# Altium schematic sheet Sheet1.SchDoc
size A4; Author: Christian Kieser; Engineer: Christian Kieser
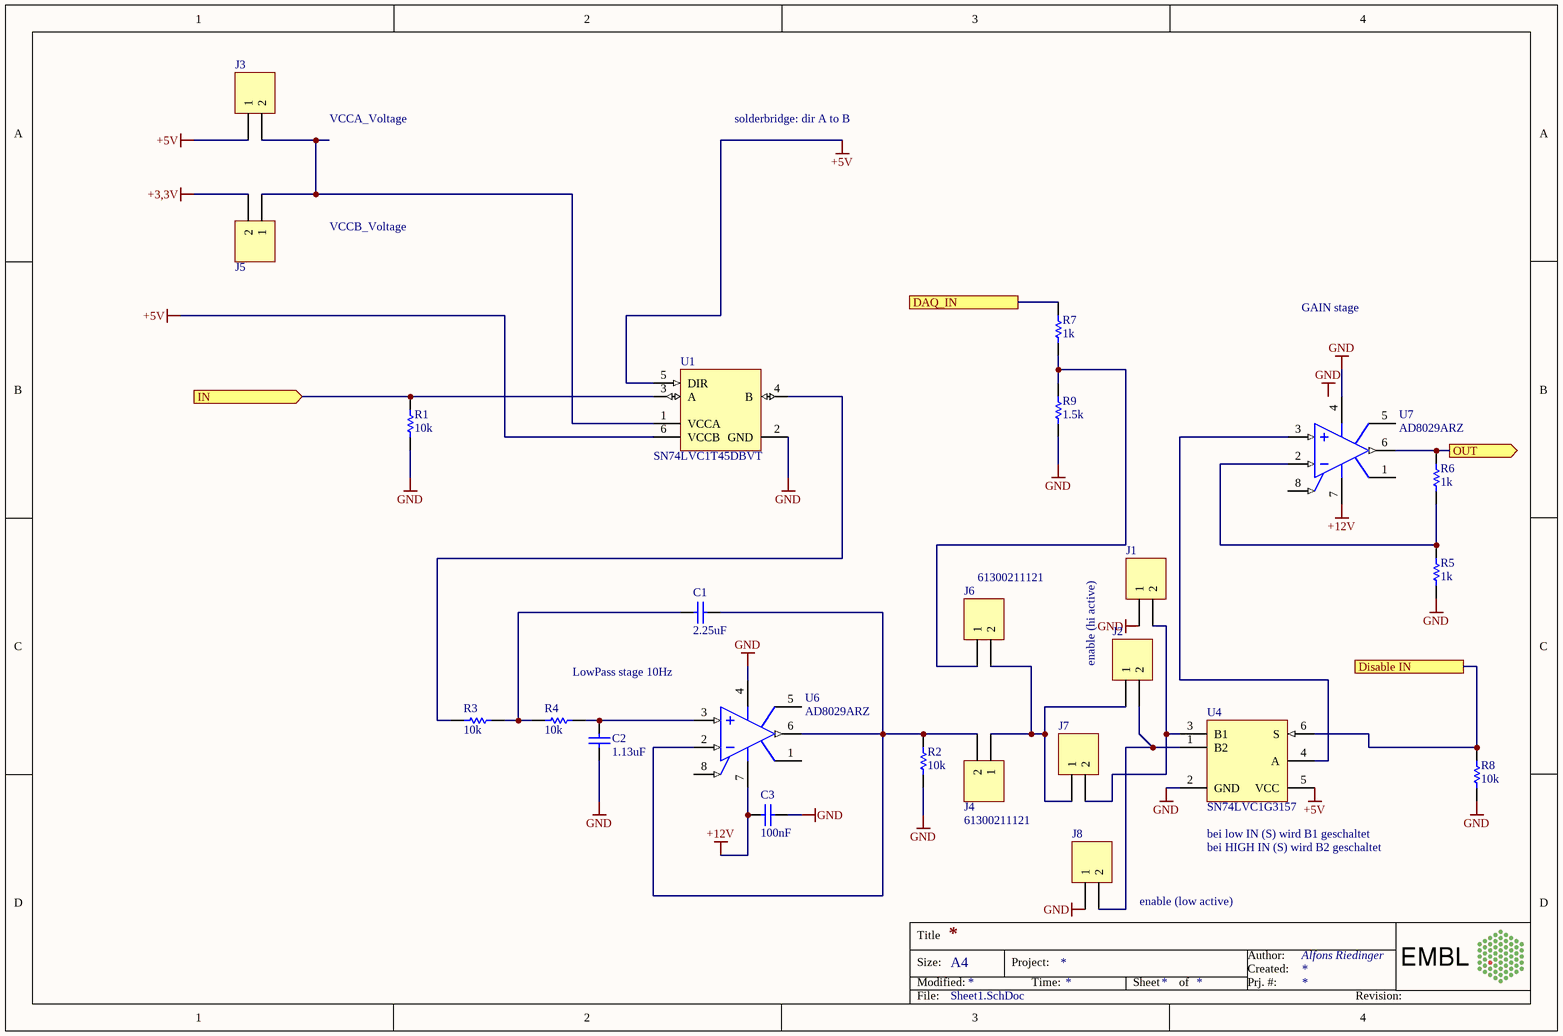
[diagram p0: Sheet1.SchDoc]

## Parts
C1  2.25uF  [CAPC1206(3216)190_N]
C2  1.13uF  [CAPC1206(3216)190_N]
C3  100nF  [CAPC2013X88X50ML20T25]
J1  61300211121  [61300211121]  (value not drawn)
J2  61300211121  [61300211121]  (value not drawn)
J3  61300211121  [61300211121]  (value not drawn)
J4  61300211121  [61300211121]
J5  61300211121  [61300211121]  (value not drawn)
J6  61300211121  [61300211121]
J7  61300211121  [61300211121]  (value not drawn)
J8  61300211121  [61300211121]  (value not drawn)
R1  10k  [YAGO-RC0805_M]
R2  10k  [YAGO-RC0805_M]
R3  10k  [YAGO-RC0805_M]
R4  10k  [YAGO-RC0805_M]
R5  1k  [YAGO-RC0805_M]
R6  1k  [YAGO-RC0805_M]
R7  1k  [YAGO-RC0805_M]
R8  10k  [YAGO-RC0805_M]
R9  1.5k  [YAGO-RC0805_M]
U1  SN74LVC1T45DBVT  [DBV0006A_M]
U4  SN74LVC1G3157  [DBV0006A_N]
U6  AD8029ARZ  [ADI-R-8_L]
U7  AD8029ARZ  [ADI-R-8_L]

## Ports
DAQ_IN, Disable IN, IN (in), OUT (out)

## Nets
+3,3V: J5.2
+5V: J3.1 U1.5(DIR) U1.6(VCCB) U4.5(VCC)
+12V: C3.2 U6.7(+VS) U7.7(+VS)
GND: C2.1 C3.1 J1.1 J8.1 R1.1 R2.1 R5.1 R8.2 R9.1 U1.2(GND) U4.2(GND) U6.4(-VS) U7.4(-VS)
DAQ_IN: R7.2 ; port DAQ_IN
Disable IN: R8.1 U4.6(S) ; port Disable IN
IN: R1.2 U1.3(A) ; port IN
OUT: R6.2 U7.6(VOUT) ; port OUT
NetC1_1: C1.1 R3.1 R4.2
NetC1_2: C1.2 J4.2 R2.2 U6.2(-IN) U6.6(VOUT)
NetC2_2: C2.2 R4.1 U6.3(+IN)
NetJ1_2: J1.2 J7.2 U4.3(B1)
NetJ2_1: J2.1 J4.1 J6.2 J7.1
NetJ2_2: J2.2 J8.2 U4.1(B2)
NetJ3_2: J3.2 J5.1 U1.1(VCCA)
NetJ6_1: J6.1 R7.1 R9.2
NetR3_2: R3.2 U1.4(B)
NetR5_2: R5.2 R6.1 U7.2(-IN)
NetU4_4: U4.4(A) U7.3(+IN)

Not connected (* = marked no-connect by the designer): U6 1(NC) 5(NC) 8(~{DISABLE}); U7 1(NC) 5(NC) 8(~{DISABLE})

## Notes on the sheet
- VCCA_Voltage
- solderbridge: dir A to B
- VCCB_Voltage
- GAIN stage
- LowPass stage 10Hz
- enable (hi active)
- (near U4) bei low IN (S) wird B1 geschaltet
- bei HIGH IN (S) wird B2 geschaltet
- (near J8) enable (low active)
- Labels drawn without touching a wire or pin: GND
- Title
- Size:
- Modified:
- A4
- Project:
- Time:
- Sheet
- of
- Created:
- Author:
- Prj. #:
- Alfons Riedinger
- File:
- Revision:

## Library data of the parts
C1 C2 = CMP-001-0138-A.1: CAP CER 1UF 10V X7R 1206; Manufacturer: Wurth Electronics Inc.; Manufacturer Part Number: 885012208013; Notification: Current market demand for these product types have resulted in fluctuating and extending lead times. Lead times may differ.; Tolerance: ±10%; Applications: General Purpose; ComponentLink1Description: 885012208013.pdf; ComponentLink1URL: http://katalog.we-online.de/pbs/datasheet/885012208013.pdf; Features: -; Height - Seated (Max): -; Lead Spacing: -; Lead Style: -; Mounting Type: Surface Mount, MLCC; Operating Temperature: -55°C ~ 125°C; Package / Case: 1206 (3216 Metric); Packaging: Cut Tape (CT); Part Status: Active; Ratings: -; Size / Dimension: 0.126" L x 0.063" W (3.20mm x 1.60mm); Supplier: Digi-Key; Supplier Part Number: 732-7685-1-ND; Temperature Coefficient: X7R; Thickness (Max): 0.051" (1.30mm); Voltage - Rated: 10V
C3 = CMP-001-0082-2: generic 0805 COG oder X7R Vielschichtkondensatoren max. +/-10%
J1-J8 = CMP-001-0071-1: 2Pol; gerade; WR-PHD 2.54 mm THT Pin Header; Brand: Wurth Electronics; Current Rating: 3 A; Insulation Resistance: 1 GOhms; Latching Type: Unlatched; Mating Post Length: 6 mm; Mounting Angle: Straight; Number of Positions: 2 Position; Pitch: 2.54 mm; Voltage Rating: 250 V; Accessory Type: -; Application: Wire to Board; ComponentLink1Description: 6130xx11121-538006.pdf; ComponentLink1URL: http://www.mouser.com/ds/2/445/6130xx11121-538006.pdf; Contact Gender: Pin (Male); Contact Material: Copper Alloy; Contact Plating: Gold; Contact Type: -; Flammability Rating: UL 94 V-0; Housing Gender: -; Housing Material: Polybutylene Terephthalate (PBT); Manufacturer: Wurth Electronics; Manufacturer Part Number: 61300211121; Minimum Order Quantity: 1; Mounting Style: Straight Pin; Number of Rows: 1 Row; Packaging: Bulk; Product: Headers; Reeling: False; RoHS - Mouser: Y; Row Spacing: -; Series: WR-PHD; Standard Pack Qty: 1000; Supplier: Mouser; Supplier Part Number: 710-61300211121; Termination Post Length: 3 mm; Termination Style: Through Hole; Type: Pin Strip; PartNumber: 61300211121
R1-R9 = CMP-001-0027-2: 0805 Yageo Standard BlackBox Resistors; Power (Watts): 0.125W, 1/8W; Temperature Coefficient: ±200ppm/°C; Tolerance: ±1%; ComponentLink1Description: PYu-RC_Group_51_RoHS_L_7.pdf; Part Status: Active; Size / Dimension: 0.079" L x 0.049" W (2.00mm x 1.25mm); Supplier Device Package: 0805; ComponentLink1URL: http://www.yageo.com/documents/recent/PYu-RC_Group_51_RoHS_L_7.pdf; Composition: Thick Film; Failure Rate: -; Features: Moisture Resistant; Height - Seated (Max): 0.024" (0.60mm); Manufacturer: Yageo; Operating Temperature: -55°C ~ 155°C; Package / Case: 0805 (2012 Metric); Packaging: Digi-Reel®
U1 = CMP-00492-1: Single-Bit Dual-Supply Bus Transceiver with Configurable Voltage Translation and 3-State Outputs, DBV0006A, SMALL T&R; Manufacturer: Texas Instruments; 3-State Output: Yes; VCC(Min)(V): 1.65; tpd @ Nom Voltage(Max)(ns): 15.5,8,5.8,4.4; Technology Family: LVC; Logic: True; Bits(#): 1; Rating: Catalog; Sub-Family: Dual Supply Translator; Schmitt Trigger: No; VCC(Max)(V): 5.5; Voltage(Nom)(V): 1.8,2.5,3.3,5; Output Drive (IOL/IOH)(Max)(mA): 32/-32; Input Type: CMOS/TTL; ICC @ Nom Voltage(Max)(mA): 0.004; Output Type: CMOS; F @ Nom Voltage(Max)(Mhz): 150; DatasheetVersion: SCES515K; Operating Temperature Range(C): -40 to 85; Generic Part Number: SN74LVC1T45; PackageReference: DBV0006A
U4 = CMP-001-0106-A.1: Analoger Schalter Single SPDT(Wechsler) SOT23-6; Manufacturer: Texas Instruments; Manufacturer Part Number: 74LVC1G3157DBVRE4; PartNumber: SN74LVC1G3157DBVR; -3db Bandwidth: 300MHz; Channel Capacitance (CS(off), CD(off)): 5.2pF; Channel-to-Channel Matching (&Delta;Ron): 100 mOhm; Charge Injection: 7pC; Crosstalk: -54dB @ 10MHz; Current - Leakage (IS(off)) (Max): 1µA; Multiplexer/Demultiplexer Circuit: 2:1; On-State Resistance (Max): 15 Ohm; Switch Time (Ton, Toff) (Max): 5.7ns, 3.8ns; Voltage - Supply, Single (V+): 1.65 V ~ 5.5 V; ComponentLink1Description: sn74lvc1g3157.pdf; ComponentLink1URL: http://www.ti.com/lit/ds/symlink/sn74lvc1g3157.pdf; Operating Temperature: -40°C ~ 85°C (TA); Package / Case: SOT-23-6; Packaging: Tape & Reel (TR); Part Status: Active; Supplier: Digi-Key; Supplier Device Package: SOT-23-6; Supplier Part Number: 74LVC1G3157DBVRE4-ND; Switch Circuit: SPDT; Voltage - Supply, Dual (V±): -
U6 U7 = CMP-00480-1: Single Channel RRIO Operational Amplifier, 125 MHz BW, 62 V/us SR, Industrial, 8-pin SOIC (R-8), Tube; Manufacturer: Analog Devices; Generic Part Number: AD8029; Slew Rate: 62V/us; V Span Min: 2.7V; Input Bias Current: 700nA; Amplifiers Per Package: 1; Iq/Amp: 1.5mA; V Span Max: 12V; Input Offset Voltage: 1.6mV; Small Signal Bandwidth: 125MHz; PackageVersion: 060506-A; ComponentLink3URL: http://www.analog.com/static/imported-files/packages/PKG_PDF/SOIC_Narrow%20(R)/R_8.pdf; ComponentLink1Description: Manufacturer URL; ComponentLink1URL: http://www.analog.com/en/index.html; Code_JEDEC: MS-012-AA; ComponentLink2URL: http://www.analog.com/static/imported-files/data_sheets/AD8029_8030_8040.pdf; ComponentLink3Description: Package Specification; PackageDescription: 8-Pin Standard Small Outline Package, Body 3.9 x 4.9 mm, Pitch 1.27 mm; PartNumber: AD8029ARZ; Mounting Technology: Surface Mount; PackageReference: R-8; DatasheetVersion: Rev. B; ComponentLink2Description: Datasheet